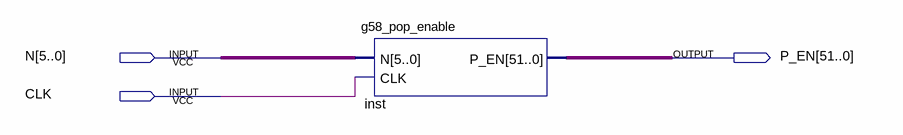
[diagram p0: schematic sheet]
// Quartus schematic g58_lab2.bdf as structural Verilog: 1 symbols, 3 pins
module g58_lab2 (
  input  [5:0] N,
  input  CLK,
  output [51:0] P_EN
);

  g58_pop_enable inst (.N(N), .CLK(CLK), .P_EN(P_EN));
endmodule
